# Altium schematic sheet Sheet1.SchDoc
size A4
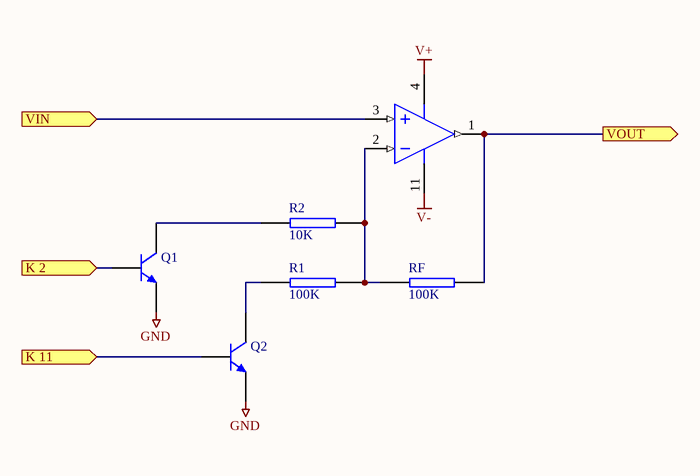
[diagram p0: Sheet1.SchDoc]

## Parts
Q1  2N3904  [TO-92A]  (value not drawn)
Q2  2N3904  [TO-92A]  (value not drawn)
R1  100K  [RES (3D) - 0805]
R2  10K  [RES (3D) - 0805]
RF  100K  [RES (3D) - 0805]
U4  MCP6L04  [SO-14]  (value not drawn)  (part A of 4)

## Ports
K 2 (in), K 11 (in), VIN (in), VOUT (out)

## Nets
GND: Q1.1(E) Q2.1(E)
V+: U4.4(VDD)
V-: U4.11(VSS)
K 2: Q1.2(B) ; port K 2
K 11: Q2.2(B) ; port K 11
VIN: U4.3(INA+) ; port VIN
VOUT: RF.2 U4.1(OUTA) ; port VOUT
NetQ1_3: Q1.3(C) R2.1
NetQ2_3: Q2.3(C) R1.1
NetR1_2: R1.2 R2.2 RF.1 U4.2(INA-)

## Library data of the parts
Q1 Q2 = 2N3904: NPN General Purpose Amplifier; Published: 8-Jun-2000; LatestRevisionDate: 15-Jan-2003; LatestRevisionNote: PCB Footprint 'BCY-W3/D4.7' replaced; DatasheetVersion: 1997; PackageVersion: Sep-1998; PackageReference: TO-92A; Publisher: Altium Limited; PackageDescription: TO, Flat Index; 3 In-Line, Axial Leads; Body Dia. 4.5mm; Leads 0.51 x 0.48 mm (max); ComponentLink1Description: Manufacturer Link; ComponentLink1URL: http://www.fairchildsemi.com/; ComponentLink2Description: Datasheet; ComponentLink2URL: http://www.fairchildsemi.com/ds/2N%2F2N3904.pdf
R1 R2 RF = RES SMD 0603: RESISTOR SMD 0603
  R1 RF: value: 100K
  R2: value: 10K
U4 = MCP6L04: Value: MCP6L04